# Altium schematic sheet DVT-PSU-LM5116-HT_2.SchDoc: DVT-PSU-LM5116-HT
size A4; Revision: 1; SheetNumber: 2; SheetTotal: 2; PartNumber: PN10048; Drawn By: Sebastian Kulik
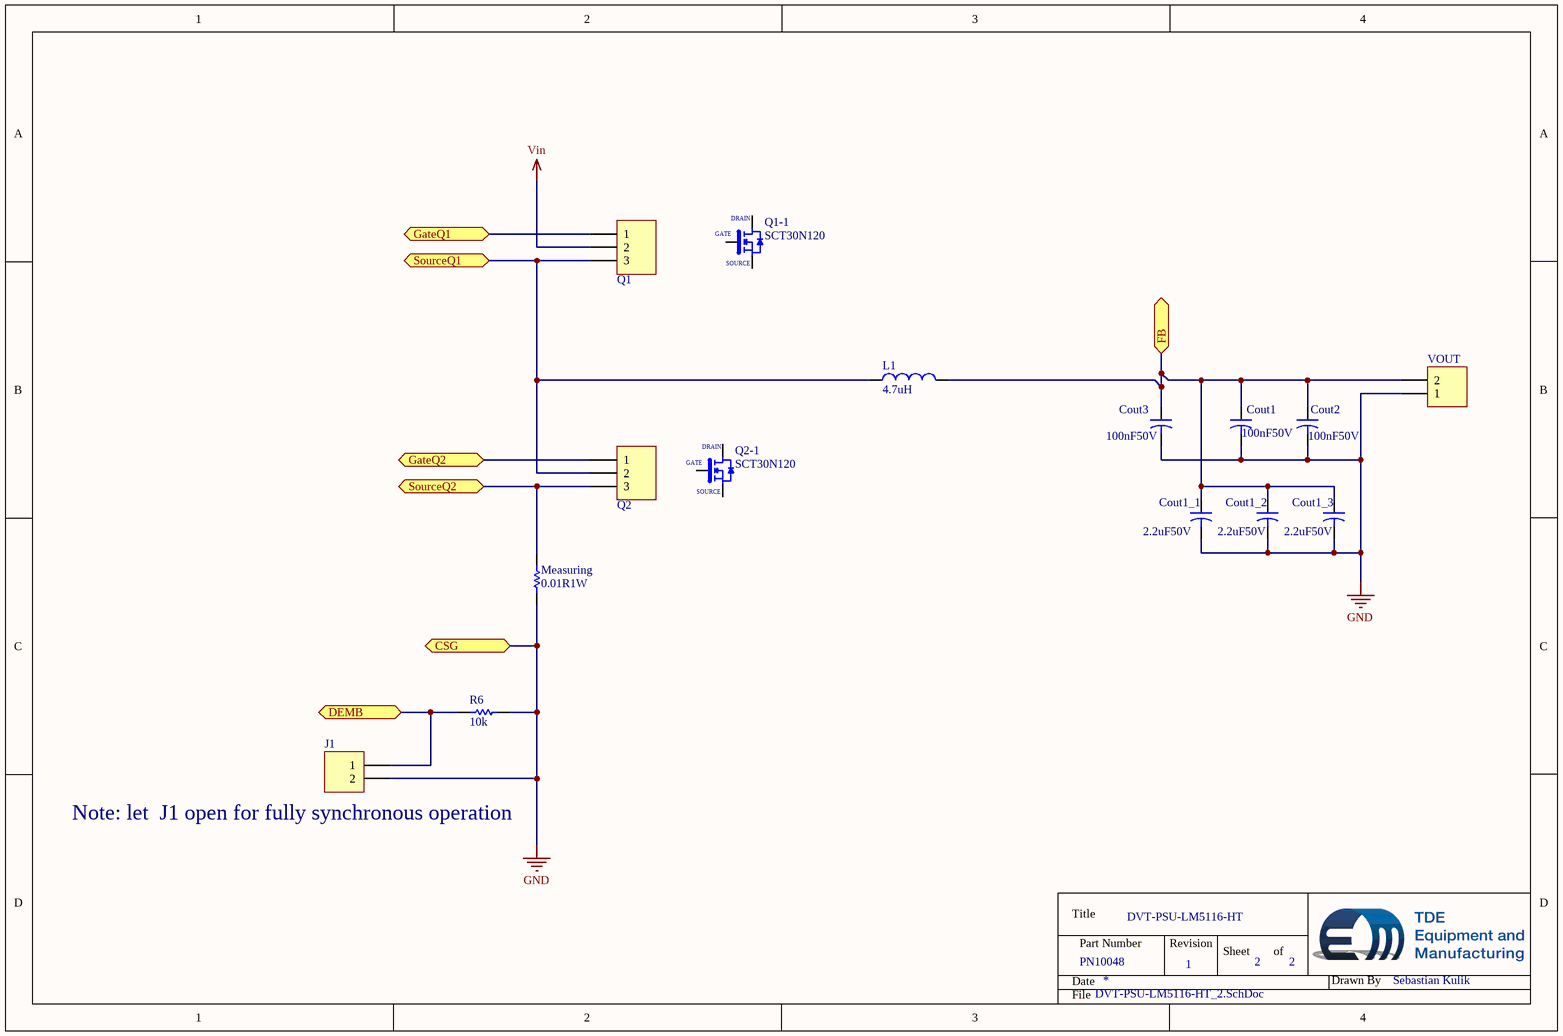
[diagram p0: DVT-PSU-LM5116-HT_2.SchDoc]

## Parts
**  Eye  [Eye]  (value not drawn)
Cout1  value 100nF50V  [Dummy-10mm]  (hidden comment: Capacitor-Dummy-THT)
Cout1_1  value 2.2uF50V  [Dummy-10mm]  (hidden comment: Capacitor-Dummy-THT)
Cout1_2  value 2.2uF50V  [Dummy-10mm]  (hidden comment: Capacitor-Dummy-THT)
Cout1_3  value 2.2uF50V  [Dummy-10mm]  (hidden comment: Capacitor-Dummy-THT)
Cout2  value 100nF50V  [Dummy-10mm]  (hidden comment: Capacitor-Dummy-THT)
Cout3  value 100nF50V  [Dummy-10mm]  (hidden comment: Capacitor-Dummy-THT)
J1  Plug_2_90_2.54  [HDR1X2]  (value not drawn)
L1  value 4.7uH  [WE-LHMI1335]  (hidden comment: 4u7H7.5A)
Measuring  value 0.01R1W  [Dummy-10mm]  (hidden comment: Resistor-Dummy-THT)
Q1  3Pol_TBL_5mm  [WE-TBL3-5]  (value not drawn)
Q1-1  SCT30N120  (graphical)
Q2  3Pol_TBL_5mm  [WE-TBL3-5]  (value not drawn)
Q2-1  SCT30N120  (graphical)
R6  value 10k  [Dummy-10mm]  (hidden comment: Resistor-Dummy-THT)
VOUT  PHOENIX_1715721  [Phoenix-2-5_08]  (value not drawn)

## Ports
CSG, DEMB, FB, GateQ1, GateQ2, SourceQ1, SourceQ2

## Nets
GND: Cout1.2 Cout1_1.2 Cout1_2.2 Cout1_3.2 Cout2.2 Cout3.2 J1.2 Measuring.1 R6.2 VOUT.1 ; port CSG
Vin: Q1.2
DEMB: J1.1 R6.1 ; port DEMB
FB: Cout1.1 Cout1_1.1 Cout1_2.1 Cout1_3.1 Cout2.1 Cout3.1 L1.2 VOUT.2 ; port FB
GateQ1: Q1.1 ; port GateQ1
GateQ2: Q2.1 ; port GateQ2
SourceQ1: L1.1 Q1.3 Q2.2 ; port SourceQ1
SourceQ2: Measuring.2 Q2.3 ; port SourceQ2

Not connected (* = marked no-connect by the designer): Q1-1 1(Drain) 2(Source) 3(Gate); Q2-1 1(Drain) 2(Source) 3(Gate)

## Notes on the sheet
- (near J1) Note: let  J1 open for fully synchronous operation
- Title
- Date
- Part Number
- Revision
- Sheet
- of
- Drawn By
- File
- (in symbol SCT30N120-Symbol) DRAIN; GATE; SOURCE

## Library data of the parts
Cout1-Cout3 = Capacitor-Dummy-THT: Deliverer PartNr: 2452193; Deliverer: Farnell; Published: 08.12.2015; Part Description: Capacitor-Dummy-THT; Publisher: Sebastian Kulik; PackageDescription: -; Manufacturer: -; Manufacturer PartNr: -; TDE-PN: -; Price: 10.64/1
Cout1_1-Cout1_3 = Capacitor-Dummy-THT: Deliverer PartNr: 2529490; Deliverer: Farnell; Published: 08.12.2015; Part Description: Capacitor-Dummy-THT; Publisher: Sebastian Kulik; PackageDescription: -; Manufacturer: -; Manufacturer PartNr: -; TDE-PN: -; Price: 1.28/1
J1 = Plug_2_90_2.54: Plug, 2-Pin; Manufacturer PartNr: 61300211021; Manufacturer: WE; Deliverer PartNr: 2356176; Deliverer: Farnell; TDE-PN: CON0010; LatestRevisionDate: 14.05.2014; LatestRevisionNote: Re-released for DXP Platform.; Publisher: Sebastian Kulik
L1 = 4u7H7.5A: WE, LHMI; Deliverer PartNr: 74437377047; TDE-PN: P0041; Deliverer: WE; Manufacturer: WE; Manufacturer PartNr: 74437377047; Published: 11.07.2016; Publisher: Sebastian Kulik; PackageDescription: LHM1335; Price: 2.48/1
Measuring = Resistor-Dummy-THT: LVR01, 0.01 ohm, 1 W, ± 1%; Manufacturer: Vishay; Manufacturer PartNr: LVR01R0100FE70; Deliverer PartNr: 1108056; Deliverer: Farnell; Published: 08.12.2015; Publisher: Sebastian Kulik; PackageDescription: -; TDE-PN: -; Part Desicription: Resistor-Dummy-THT; Price: 2.61/1
Q1 Q2 = 3Pol_TBL_5mm: Plug,-3-Pin; Manufacturer: WE; Manufacturer PartNr: 691102710003; Deliverer PartNr: 826-7220; Deliverer: RS; TDE-PN: CON0044; Publisher: Sebastian Kulik; Price: 1.26/1
Q1-1 Q2-1 = SCT30N120-Symbol
R6 = Resistor-Dummy-THT: Deliverer PartNr: 148-736; Deliverer: RS; Published: 08.12.2015; Publisher: Sebastian Kulik; PackageDescription: -; Manufacturer: -; Manufacturer PartNr: -; TDE-PN: -; Part Desicription: Resistor-Dummy-THT; Price: 0.027/10
VOUT = 2Pol_1715721: Phoenix, 2 pol, 5.08mm, 22A, 715721; Deliverer PartNr: 193-0564; Deliverer: RS; TDE-PN: CON0008; LatestRevisionDate: 02.05.2014; LatestRevisionNote: Re-released for DXP Platform.; Publisher: Sebastian Kulik; Manufacturer PartNr: 1715721; Manufacturer: Phoenix; PackageDescription: Phoenix-2-5_08; Price: 0.976/5